# EAGLE design voiture (EAGLE 8.7.0)
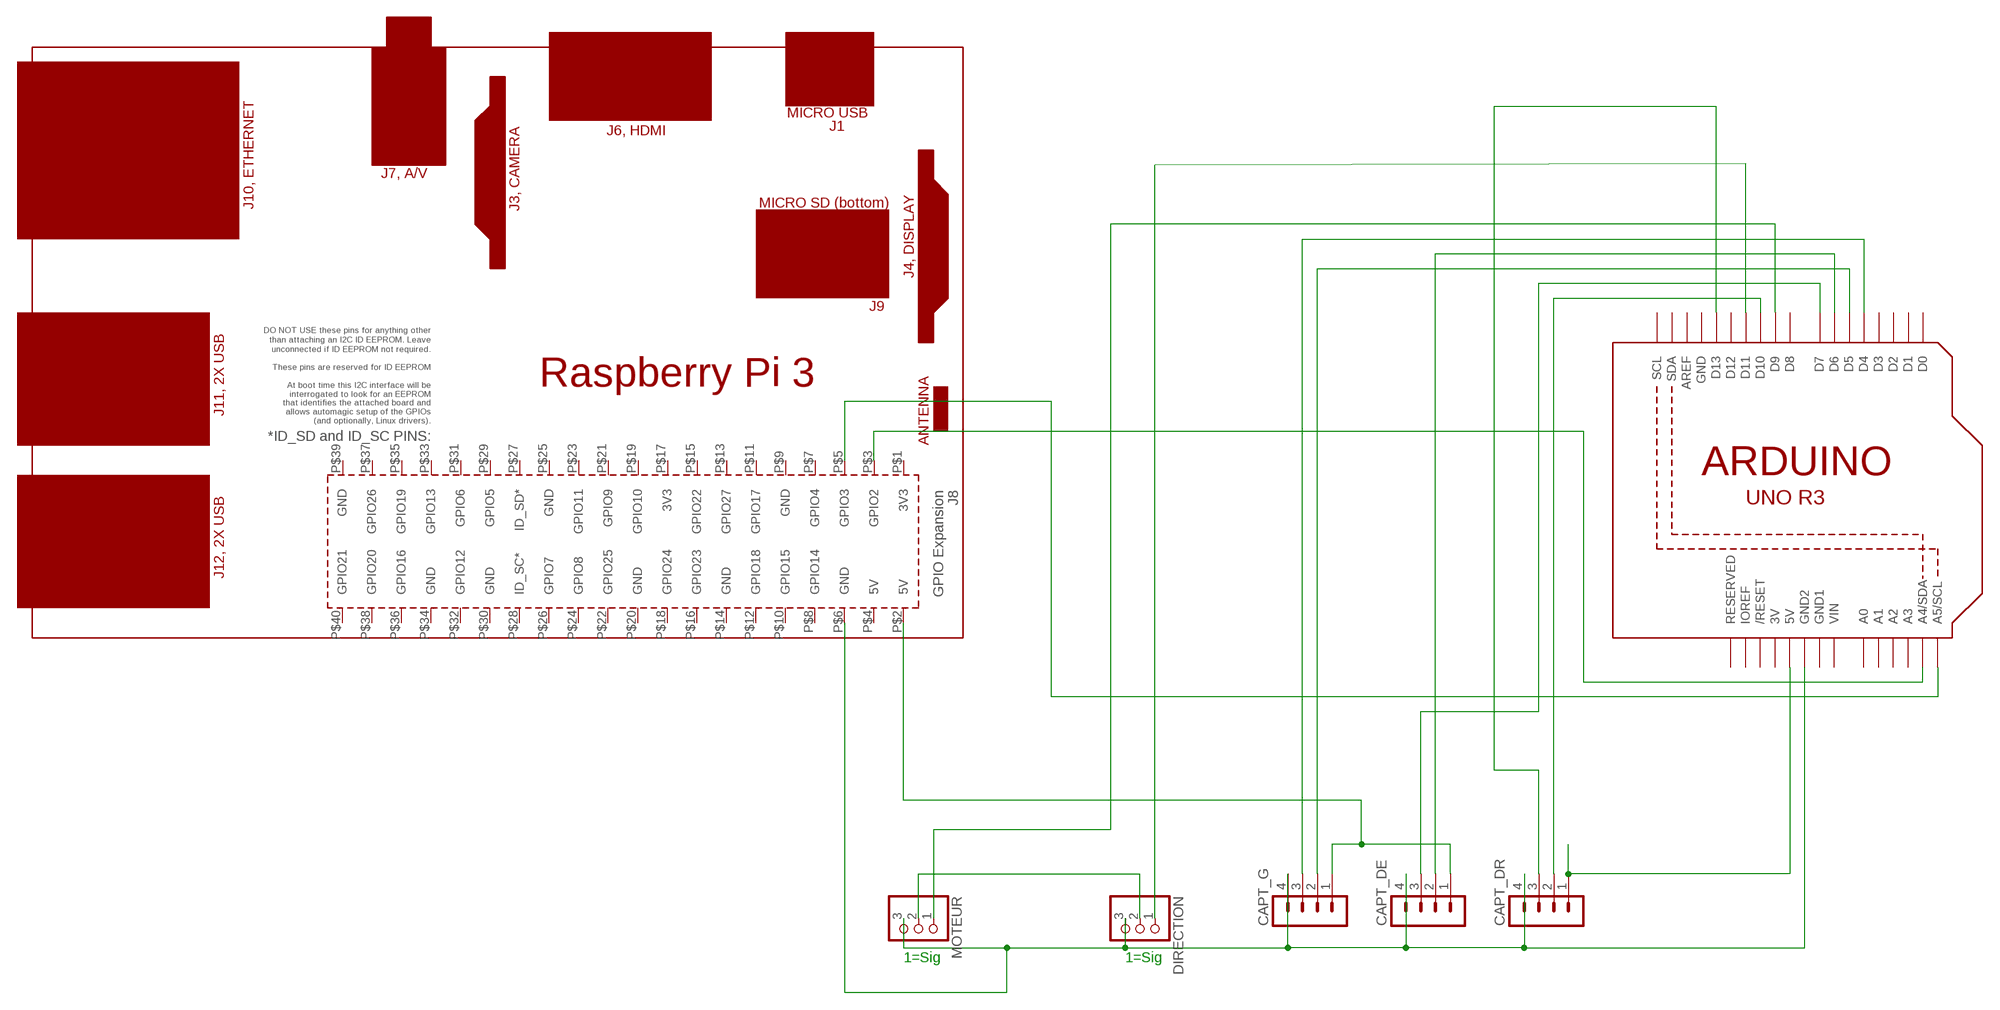
[diagram p0: schematic, sheet 1]

## Parts
CAPT_DE  MA04-1  [MA04-1]
CAPT_DR  MA04-1  [MA04-1]
CAPT_G  MA04-1  [MA04-1]
DIRECTION  PINHD-1X3  [1X03]
MOTEUR  PINHD-1X3  [1X03]
PCB1  RPI3  [RPI3]
U1  ARDUINOR3-BPLACE  [ARDUINOR3-BPLACE]

## Nets
N$1: DIRECTION.2 MOTEUR.2
N$2: CAPT_DE.4 CAPT_DR.4 CAPT_G.4 DIRECTION.3 MOTEUR.3 PCB1.P$6(GND) U1.GND2
N$3: DIRECTION.1 U1.D11
N$4: MOTEUR.1 U1.D9
N$5: CAPT_DR.1 U1.5V
N$6: CAPT_DE.3 U1.D7
N$7: CAPT_DE.2 U1.D6
N$9: PCB1.P$3(GPIO2) U1.A4(A4/SDA)
N$10: PCB1.P$5(GPIO3) U1.A5(A5/SCL)
N$11: CAPT_G.2 U1.D5
N$12: CAPT_G.3 U1.D4
N$13: CAPT_DR.2 U1.D10
N$14: CAPT_DR.3 U1.D13
N$15: CAPT_DE.1 CAPT_G.1 PCB1.P$2(5V)
Unconnected: PCB1.P$1(3V3) PCB1.P$4(5V) PCB1.P$7(GPIO4) PCB1.P$8(GPIO14) PCB1.P$9(GND) PCB1.P$10(GPIO15) PCB1.P$11(GPIO17) PCB1.P$12(GPIO18) PCB1.P$13(GPIO27) PCB1.P$14(GND) PCB1.P$15(GPIO22) PCB1.P$16(GPIO23) PCB1.P$17(3V3) PCB1.P$18(GPIO24) PCB1.P$19(GPIO10) PCB1.P$20(GND) PCB1.P$21(GPIO9) PCB1.P$22(GPIO25) PCB1.P$23(GPIO11) PCB1.P$24(GPIO8) PCB1.P$25(GND) PCB1.P$26(GPIO7) PCB1.P$27(ID_SD*) PCB1.P$28(ID_SC*) PCB1.P$29(GPIO5) PCB1.P$30(GND) PCB1.P$31(GPIO6) PCB1.P$32(GPIO12) PCB1.P$33(GPIO13) PCB1.P$34(GND) PCB1.P$35(GPIO19) PCB1.P$36(GPIO16) PCB1.P$37(GPIO26) PCB1.P$38(GPIO20) PCB1.P$39(GND) PCB1.P$40(GPIO21) U1.A0 U1.A1 U1.A2 U1.A3 U1.AREF U1.D0 U1.D1 U1.D2 U1.D3 U1.D8 U1.D12 U1.IOREF U1.RESERVED U1.RESET(/RESET) U1.SCL U1.SDA

## Notes on the sheet
- 1=Sig | 1=Sig

## Power pins joined to a net without a drawn wire
3V: U1.3V
GND: U1.GND
GND1: U1.GND1
VIN: U1.VIN

## Library data of the parts
CAPT_DE CAPT_DR CAPT_G = con-lstb:MA04-1: PIN HEADER; OC_FARNELL: unknown; OC_NEWARK: unknown
DIRECTION MOTEUR = adafruit:PINHD-1X3: PIN HEADER
PCB1 = e14_Rpi3_RevA:RPI3: Device for Raspberry Pi 3 board created by Dave Young for www.element14.com More information and support community is available at https://www.element14.com/community/community/raspberry-pi
U1 = adafruit:ARDUINOR3: This is a new object for the new Arduino R3 - with extra pins that you may want to use (such as IOref, and duplicated A4/A5

## Board
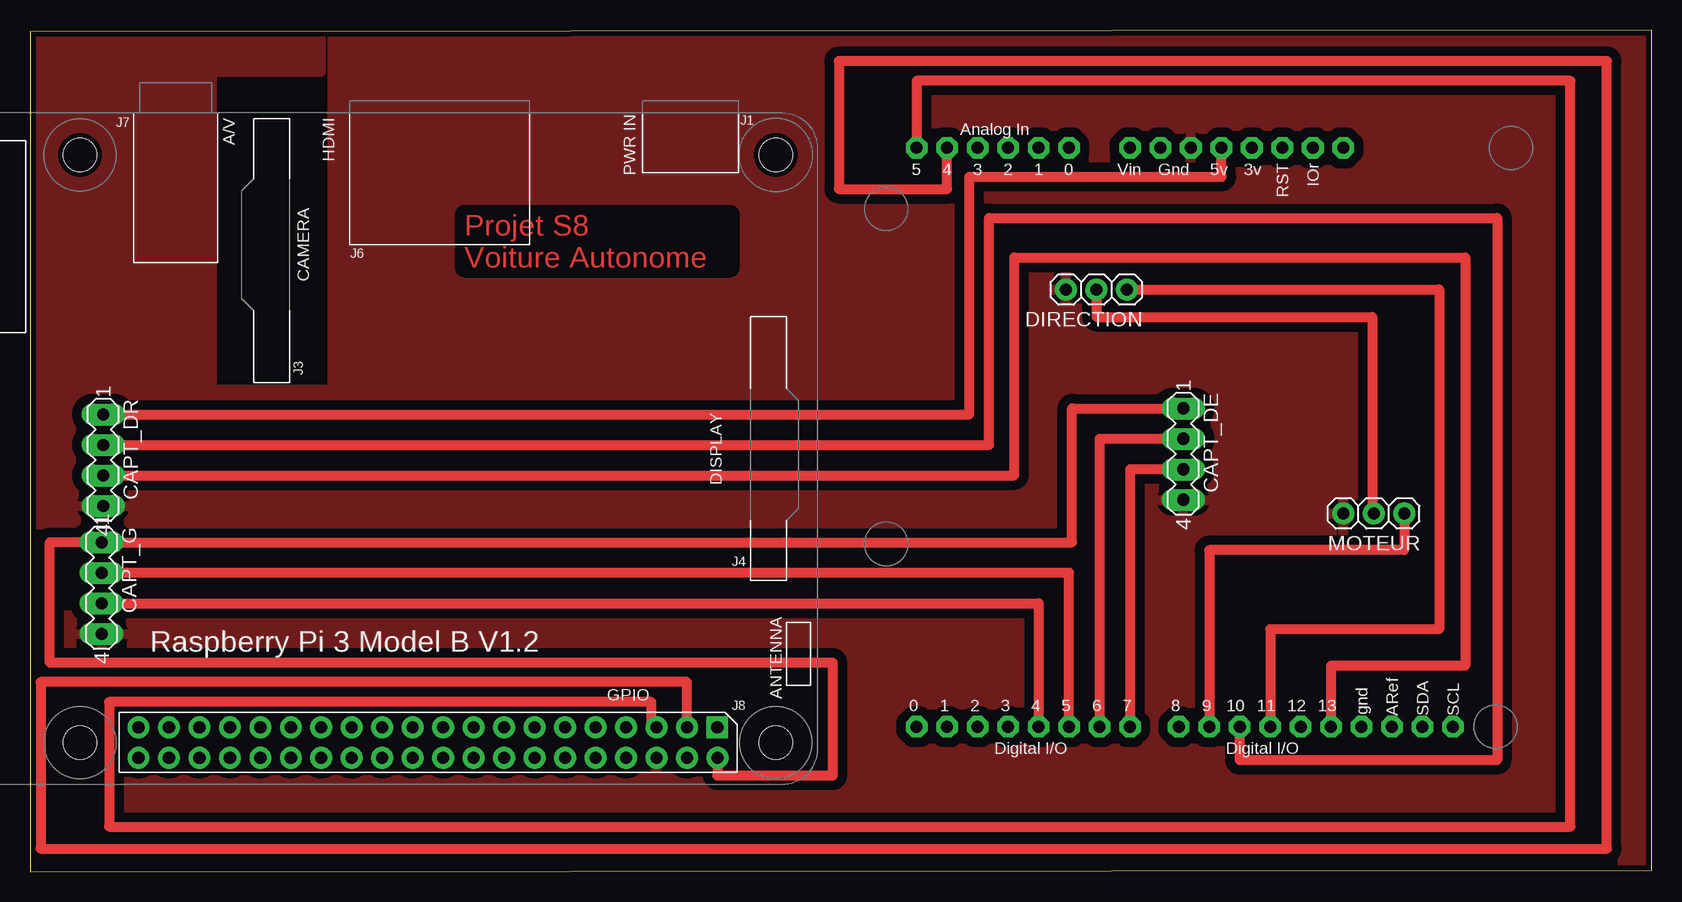
[diagram p1: board, top side]
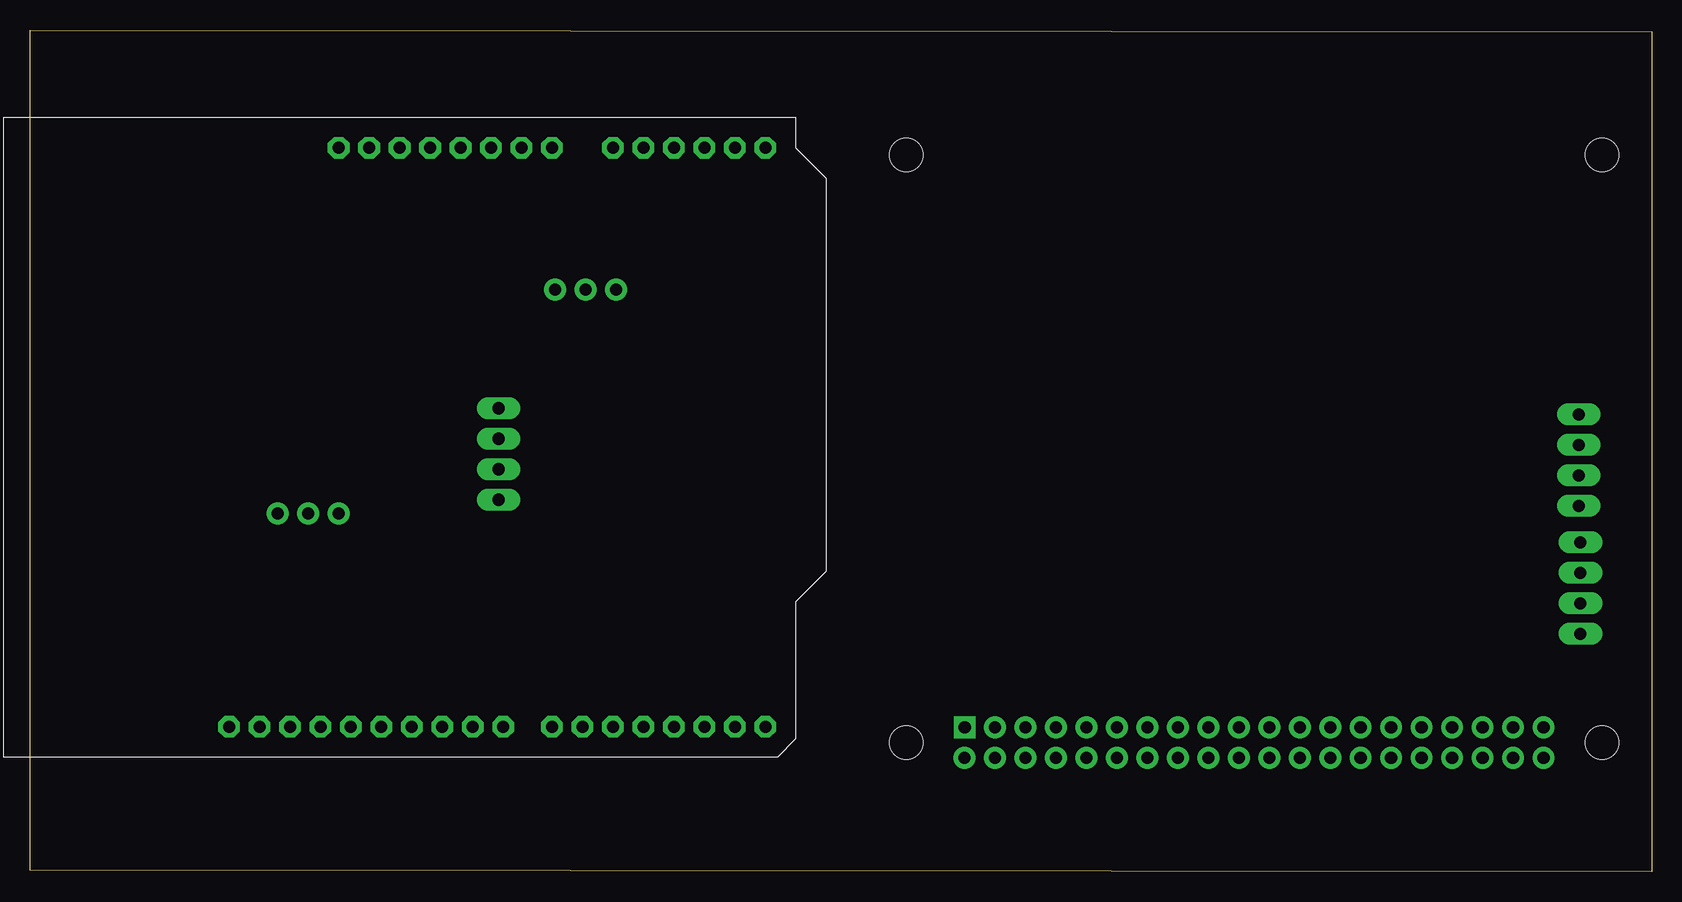
[diagram p2: board, bottom side, seen from below]

Size 135.21 x 70.19 mm. Coordinates in mm from the lower left corner, seen from the top.
Outline: 0.03,0 135.21,0.13 135.21,70.19 0,70.06 0.03,0
Copper layers (1*16): Top 0.035mm / dielectric 1.55mm / Bottom 0.035mm
Design rules "default": minimum track width 0.8mm, minimum drill 0.6mm, track to track 0.8mm, track to pad 0.7mm, pad to pad 0.7mm, via to via 0.7mm, smd to smd 0.1mm, copper to edge 0.45mm, drill to drill 0.3mm, minimum pad ring 0.4mm, minimum via ring 0.4mm, stop-mask expansion 0.1mm, vias tented up to drill 0mil, thermal gap 0.4mm

### Footprints (pad centres in the part's own frame; a part is rotated, then mirrored left to right if it is on the bottom)
MA04-1 = drill 1.016 long: 1 -3.81,0; 2 -1.27,0; 3 1.27,0; 4 3.81,0
1X03 = drill 1.016: 1 -2.54,0; 2 0,0; 3 2.54,0
RPI3 = drill 1.016 square: P$1 8.37,51.23 | drill 1.016: P$2 8.357,53.772; P$3 10.897,51.232; P$4 10.897,53.772; P$5 13.437,51.232; P$6 13.437,53.772; P$7 15.977,51.232; P$8 15.977,53.772; P$9 18.517,51.232; P$10 18.517,53.772; P$11 21.057,51.232; P$12 21.057,53.772; P$13 23.597,51.232; P$14 23.597,53.772; P$15 26.137,51.232; P$16 26.137,53.772; P$17 28.677,51.232; P$18 28.677,53.772; P$19 31.217,51.232; P$20 31.217,53.772; P$21 33.757,51.232; P$22 33.757,53.772; P$23 36.297,51.232; P$24 36.297,53.772; P$25 38.837,51.232; P$26 38.837,53.772; P$27 41.377,51.232; P$28 41.377,53.772; P$29 43.917,51.232; P$30 43.917,53.772; P$31 46.457,51.232; P$32 46.457,53.772; P$33 48.997,51.232; P$34 48.997,53.772; P$35 51.537,51.232; P$36 51.537,53.772; P$37 54.077,51.232; P$38 54.077,53.772; P$39 56.617,51.232; P$40 56.617,53.772 | hole 2.75: 3.5,3.5; 61.5,3.5; 3.5,52.5; 61.5,52.5
ARDUINOR3-BPLACE = drill 1 pad 1.676 octagon: 3V 35.56,2.54; 5V 38.1,2.54; A0 50.8,2.54; A1 53.34,2.54; A2 55.88,2.54; A3 58.42,2.54; A4 60.96,2.54; A5 63.5,2.54; AREF 23.876,50.8; D0 63.5,50.8; D1 60.96,50.8; D2 58.42,50.8; D3 55.88,50.8; D4 53.34,50.8; D5 50.8,50.8; D6 48.26,50.8; D7 45.72,50.8; D8 41.656,50.8; D9 39.116,50.8; D10 36.576,50.8; D11 34.036,50.8; D12 31.496,50.8; D13 28.956,50.8; GND 26.416,50.8; GND1 43.18,2.54; GND2 40.64,2.54; IOREF 30.48,2.54; RESERVED 27.94,2.54; RESET 33.02,2.54; SCL 18.796,50.8; SDA 21.336,50.8; VIN 45.72,2.54

### Placement (x,y rotation side)
CAPT_DE  96.14,34.83 270 top
CAPT_DR  6.1,34.32 270 top
CAPT_G  5.97,23.65 270 top
DIRECTION  88.9,48.55 180 top
MOTEUR  112.01,29.88 180 top
PCB1  65.66,63.28 180 top
U1  137.41,62.9 180 top

### Tracks (layer width: path | path; a pad name or v marks a point on that pad's centre or on a via)
N$1
  Top 0.813: DIRECTION.2 88.9,46.26 111.89,46.26 111.89,29.88 MOTEUR.2
N$2
  pour Top: -4.83,0.19 135.17,0.19 135.17,70.19 25.17,70.19 25.17,40.19 15.17,40.19 15.17,66.71 24.26,66.71 24.26,70.19 -4.83,70.19
N$3
  Top 0.813: DIRECTION.1 117.48,48.55 117.48,20.23 103.38,20.23 U1.D11
N$4
  Top 0.813: MOTEUR.1 114.55,26.83 98.3,26.83 U1.D9
N$5
  Top 0.813: CAPT_DR.1 78.3,38.13 78.3,57.95 99.31,57.95 U1.5V
N$6
  Top 0.813: CAPT_DE.3 91.69,33.56 U1.D7
N$7
  Top 0.813: CAPT_DE.2 89.15,36.1 U1.D6
N$9
  Top 0.813: PCB1.P$3 54.76,15.82 0.89,15.82 0.89,1.94 131.44,1.94 131.44,67.6 67.44,67.6 67.44,56.93 76.45,56.93 U1.A4
N$10
  Top 0.813: PCB1.P$5 51.8,12.05 51.8,14.16 6.6,14.16 6.6,3.75 128.4,3.75 128.4,65.95 73.91,65.95 U1.A5
N$11
  Top 0.813: CAPT_G.2 86.61,24.93 U1.D5
N$12
  Top 0.813: CAPT_G.3 84.07,22.39 U1.D4
N$13
  Top 0.813: CAPT_DR.2 79.95,35.59 79.95,54.52 122.3,54.52 122.3,9.3 100.84,9.3 U1.D10
N$14
  Top 0.813: CAPT_DR.3 82.04,33.05 82.04,51.21 119.63,51.21 119.63,17.18 108.46,17.18 U1.D13
N$15
  Top 0.813: PCB1.P$2 57.3,8.03 66.93,8.03 66.93,17.43 1.65,17.43 1.65,27.46 CAPT_G.1 86.87,27.46 86.87,38.64 CAPT_DE.1

### Text on the board
Top: Projet S8 / Voiture Autonome